# Altium schematic sheet schéma_NCS2.SchDoc
size A4
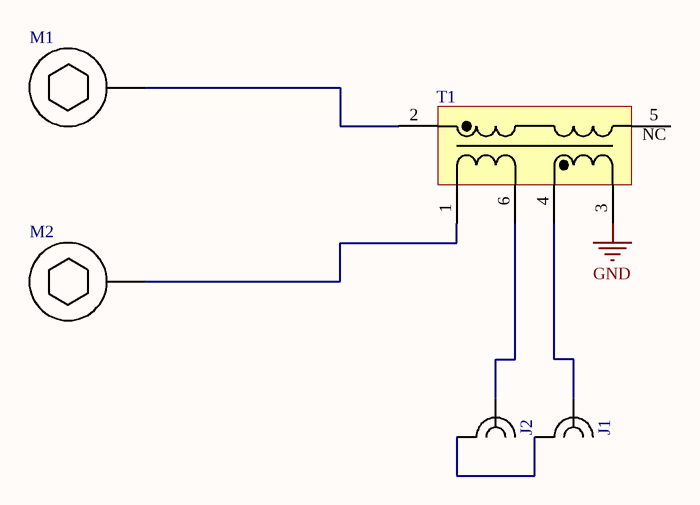
[diagram p0: schéma_NCS2.SchDoc]

## Parts
J1  CONSMA001-G  [SMA TH Vertical Linx CONSMA001-G]  (value not drawn)
J2  CONSMA001-G  [SMA TH Vertical Linx CONSMA001-G]  (value not drawn)
M1  (no value)  [Screw Hex Socket M2.5X4 Connected]
M2  (no value)  [Screw Hex Socket M2.5X4 Connected]
T1  {Value}  [NCS2-771-75+]  (value not drawn)

## Nets
GND: T1.3
NetJ1_2: J1.2 J2.2
NetM1_1: M1.1 T1.2
NetM2_1: M2.1 T1.1

Not connected (* = marked no-connect by the designer): J1 1; J2 1; T1 4 5 6

## Notes on the sheet
- (in symbol NCS2-771-75+) NC

## Library data of the parts
J1 J2 = SMA TH VERTICAL LINX CONSMA001-G: Value: CONSMA001-G
M1 M2 = Screw Hex Socket Connected: Screw Hex Socket Connected BN610
T1 = NCS2-771-75+: Mini-Circuits RF Transformer; Value: {Value}